# Altium schematic sheet POWER_SHEET.SchDoc
size 381 x 241 mm; SheetNumber: 10; SheetTotal: 12
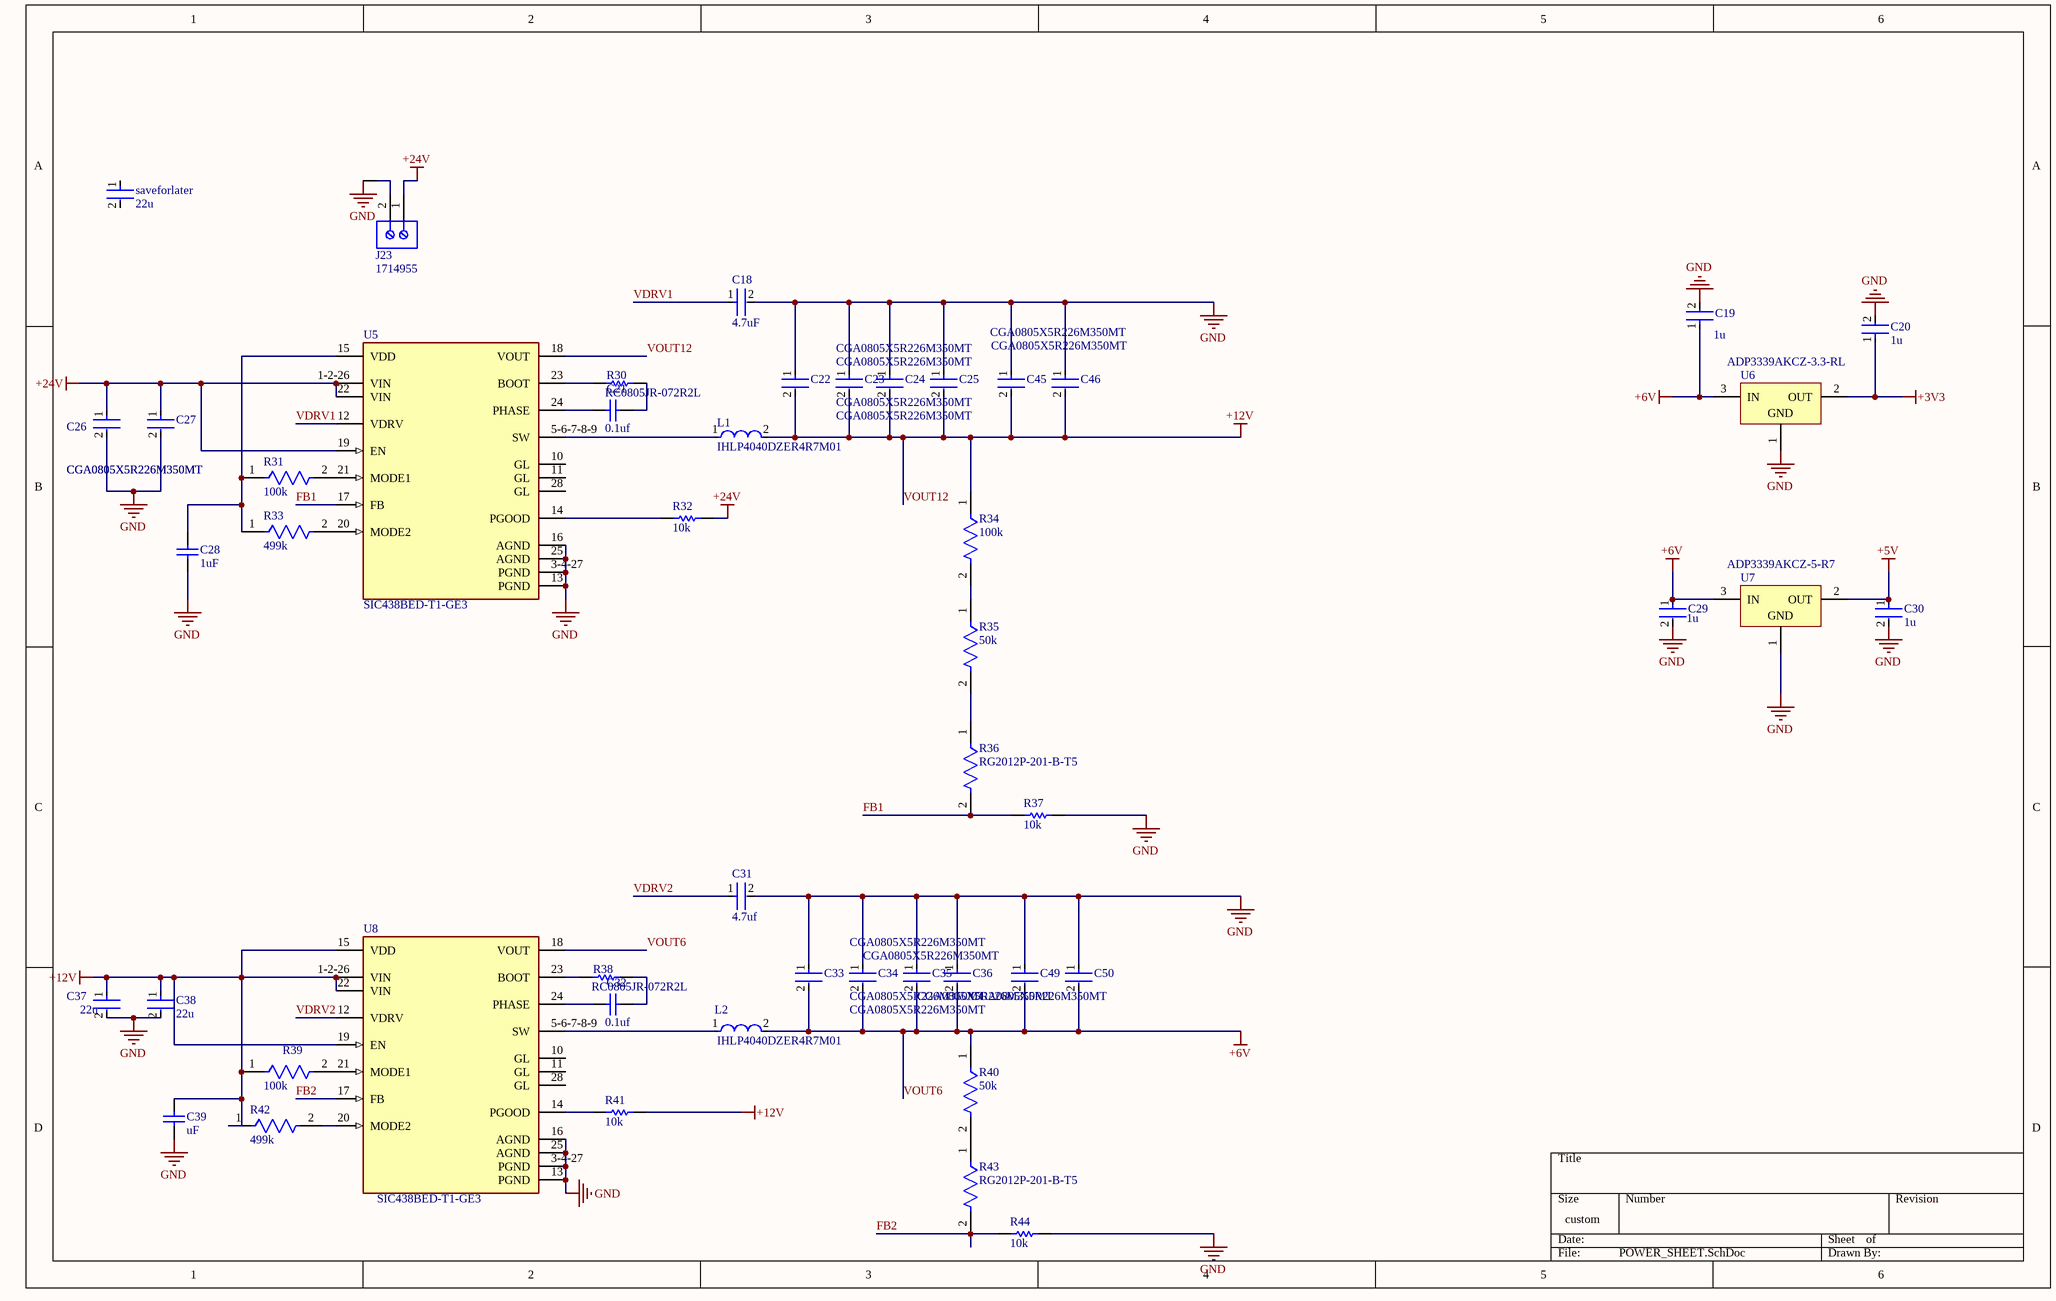
[diagram p0: POWER_SHEET.SchDoc]

## Parts
C18  4.7uF  [FP-CL21-IPC_A]
C19  1u  [FP-CL21-IPC_A]
C20  1u  [FP-CL21-IPC_A]
C21  0.1uf  [CAPC2013X94X50LL20T25]
C22  CGA0805X5R226M350MT  [FP-GRM21B-0_2-e0_2_0_7-IPC_A]
C23  CGA0805X5R226M350MT  [FP-GRM21B-0_2-e0_2_0_7-IPC_A]
C24  CGA0805X5R226M350MT  [FP-GRM21B-0_2-e0_2_0_7-IPC_A]
C25  CGA0805X5R226M350MT  [FP-GRM21B-0_2-e0_2_0_7-IPC_A]
C26  CGA0805X5R226M350MT  [FP-GRM21B-0_2-e0_2_0_7-IPC_A]
C27  CGA0805X5R226M350MT  [FP-GRM21B-0_2-e0_2_0_7-IPC_A]
C28  1uF  [CAPC2013X94X50ML25T25]
C29  1u  [FP-CL21-IPC_A]
C30  1u  [FP-CL21-IPC_A]
C31  4.7uf  [FP-CL21-IPC_A]
C32  0.1uf  [CAPC2013X94X50LL20T25]
C33  CGA0805X5R226M350MT  [FP-GRM21B-0_2-e0_2_0_7-IPC_A]
C34  CGA0805X5R226M350MT  [FP-GRM21B-0_2-e0_2_0_7-IPC_A]
C35  CGA0805X5R226M350MT  [FP-GRM21B-0_2-e0_2_0_7-IPC_A]
C36  CGA0805X5R226M350MT  [FP-GRM21B-0_2-e0_2_0_7-IPC_A]
C37  22u  [FP-CL21-IPC_C]
C38  22u  [FP-CL21-IPC_C]
C39  uF  [CAPC2013X94X50ML25T25]
C45  CGA0805X5R226M350MT  [FP-GRM21B-0_2-e0_2_0_7-IPC_A]
C46  CGA0805X5R226M350MT  [FP-GRM21B-0_2-e0_2_0_7-IPC_A]
C49  CGA0805X5R226M350MT  [FP-GRM21B-0_2-e0_2_0_7-IPC_A]
C50  CGA0805X5R226M350MT  [FP-GRM21B-0_2-e0_2_0_7-IPC_A]
J23  1714955  [PHOE-1714955_V]
L1  IHLP4040DZER4R7M01  [FP-IHLP-4040DZ-FP_3_124x3-MFG]
L2  IHLP4040DZER4R7M01  [FP-IHLP-4040DZ-FP_3_124x3-MFG]
R30  RC0805JR-072R2L  [RESC2013X60X35LL10T20]
R31  100k  [FP-ESR10-MFG]
R32  10k  [RESC2013X60X40LL20T25_A]
R33  499k  [FP-RT0805-MFG]
R34  100k  [FP-ESR10-MFG]
R35  50k  [FP-PNM0805-MFG]
R36  RG2012P-201-B-T5  [FP-RG2012-IPC_A]
R37  10k  [RESC2013X60X40LL20T25_A]
R38  RC0805JR-072R2L  [RESC2013X60X35LL10T20]
R39  100k  [FP-ESR10-MFG]
R40  50k  [FP-PNM0805-MFG]
R41  10k  [RESC2013X60X40LL20T25_A]
R42  499k  [FP-RT0805-MFG]
R43  RG2012P-201-B-T5  [FP-RG2012-IPC_A]
R44  10k  [RESC2013X60X40LL20T25_A]
saveforlater  22u  [FP-CL21-IPC_C]
U5  SIC438BED-T1-GE3  [FP-T22-0442-MFG]
U6  ADP3339AKCZ-3.3-RL  [ADI-KC-3_N]
U7  ADP3339AKCZ-5-R7  [ADI-KC-3_N]
U8  SIC438BED-T1-GE3  [FP-T22-0442-MFG]

## Nets
+3V3: C20.1 U6.2(OUT)
+5V: C30.1 U7.2(OUT)
+24V: C26.1 C27.1 J23.1 R32.2 U5.1-2-26(VIN) U5.19(EN) U5.22(VIN)
GND: C18.2 C19.2 C20.2 C22.1 C23.1 C24.1 C25.1 C26.2 C27.2 C28.1 C29.2 C30.2 C31.2 C33.1 C34.1 C35.1 C36.1 C37.2 C38.2 C39.1 C45.1 C46.1 C49.1 C50.1 J23.2 R37.2 R44.2 U5.3-4-27(PGND) U5.13(PGND) U5.16(AGND) U5.25(AGND) U6.1(GND) U7.1(GND) U8.3-4-27(PGND) U8.13(PGND) U8.16(AGND) U8.25(AGND)
VOUT6: C19.1 C29.1 C33.2 C34.2 C35.2 C36.2 C49.2 C50.2 L2.2 R40.1 U6.3(IN) U7.3(IN) U8.18(VOUT)  [also labelled +6V]
VOUT12: C22.2 C23.2 C24.2 C25.2 C37.1 C38.1 C39.2 C45.2 C46.2 L1.2 R34.1 R39.1 R41.2 R42.1 U5.18(VOUT) U8.1-2-26(VIN) U8.15(VDD) U8.19(EN) U8.22(VIN)  [also labelled +12V]
FB1: R36.2 R37.1 U5.17(FB)
FB2: R43.2 R44.1 U8.17(FB)
VDRV1: C18.1 U5.12(VDRV)
VDRV2: C31.1 U8.12(VDRV)
NetC21_1: C21.1 U5.24(PHASE)
NetC21_2: C21.2 R30.2
NetC28_2: C28.2 R31.1 R33.1 U5.15(VDD)
NetC32_1: C32.1 U8.24(PHASE)
NetC32_2: C32.2 R38.2
NetL1_1: L1.1 U5.5-6-7-8-9(SW)
NetL2_1: L2.1 U8.5-6-7-8-9(SW)
NetR30_1: R30.1 U5.23(BOOT)
NetR31_2: R31.2 U5.21(MODE1)
NetR32_1: R32.1 U5.14(PGOOD)
NetR33_2: R33.2 U5.20(MODE2)
NetR34_2: R34.2 R35.1
NetR35_2: R35.2 R36.1
NetR38_1: R38.1 U8.23(BOOT)
NetR39_2: R39.2 U8.21(MODE1)
NetR40_2: R40.2 R43.1
NetR41_1: R41.1 U8.14(PGOOD)
NetR42_2: R42.2 U8.20(MODE2)

Not connected (* = marked no-connect by the designer): saveforlater 1 2; U5 10(GL) 11(GL) 28(GL); U8 10(GL) 11(GL) 28(GL)

## Library data of the parts
C18 C31 = CMP-13271-002624-1: CL21 Series 0805 4.7uF 25V ±10% Tolerance X5R Multilayer Ceramic Chip Capacitor; Case Code (Imperial): 0805; Thickness: 0.055inch; Mount: Surface Mount; Case Code (Metric): 2012; Capacitance: 4.7uF; Depth: 1.25mm; Lead Free: Lead Free; Case/Package: 0805; Voltage Rating: 25V; Package Quantity: 1; Width: 0.049inch; Radiation Hardening: No; Voltage Rating (DC): 25V; Length: 2mm; Dielectric: X5R; Height: 1.25mm; Packaging: Tape and Reel; Tolerance: 10%; Min Operating Temperature: -55°C; Max Operating Temperature: 85°C
C19 C20 C29 C30 = CMP-13271-003098-1: CL21 Series 0805 1uF 16V ±10% Tolerance X7R Multilayer Ceramic Chip Capacitor; Case Code (Metric): 2012; Width: 0.049inch; Thickness: 0.053inch; Voltage Rating: 16V; Max Operating Temperature: 125°C; Case Code (Imperial): 0805; Height: 1.25mm; Length: 2mm; Case/Package: 0805; Lead Free: Lead Free; Mount: Surface Mount; Capacitance: 1uF; Tolerance: 10%; Voltage Rating (DC): 16V; Min Operating Temperature: -55°C; Contact Plating: Tin; Depth: 1.25mm; Packaging: Tape and Reel; Package Quantity: 1; Voltage: 16V; Dielectric: X7R; Radiation Hardening: No
C21 C32 = CMP-2007-04344-1: Manufacturer: AVX Interconnect / Elco; Part Number: 08055A6R0CAT2A
C22-C27 C33-C36 C45 C46 C49 C50 = CMP-2000-07599-2: Chip Multilayer Ceramic Capacitors for General Purpose, 0805, 100uF, X5R, 15%, 20%, 6.3V; Length: 0.079inch; Dielectric: X5R; Case Code (Metric): 2012; Max Operating Temperature: 85°C; Voltage Rating (DC): 6.3V; Min Operating Temperature: -55°C; Tolerance: 20%; Packaging: Cut Tape; Voltage Rating: 6.3V; Capacitance: 100uF; REACH SVHC: No SVHC; Width: 0.049inch; Mount: Surface Mount; Case/Package: 0805; Case Code (Imperial): 0805; Lead Free: Lead Free; Thickness: 0.057inch
C28 C39 = CMP-2007-04103-1: Manufacturer: AVX Interconnect / Elco; Part Number: LD055C224KAB2A
C37 C38 saveforlater = CMP-13271-003225-1: CL21 Series 0805 22uF 25V ±20% Tolerance X5R Multilayer Ceramic Chip Capacitor
J23 = CMP-2000-05797-1: PC Terminal Block, Pitch 6.35 mm, 1 x 2 Position, Height 21.5 mm, Tail Lenght 5.1 mm, RoHS, Bulk; Manufacturer: Phoenix Contact; Package Description: PC Terminal Block, Pitch 6.35 mm, 1 x 2 Position, Height 21.5 mm, Tail Lenght 5.1 mm; Datasheet URL: http://media.digikey.com/pdf/Data%20Sheets/Phoenix%20Contact%20PDFs/1714955.pdf; Package Reference: 1714955; Manufacturer URL: http://www.phoenixcontact.com/; Datasheet Version: 02/2010; Mounting Technology: ThroughHole
L1 L2 = CMP-02424-000650-1: Commercial Inductors, High Saturation Series 4.7uH 9.5A 16.5mΩ 20%; Shielding: Shielded; DC Resistance (DCR): 16.5mR; Core Material: Metal; Self Resonant Frequency: 5MHz; Test Frequency: 100kHz; Saturation Current: 17A; Min Operating Temperature: -55°C; Max DC Current: 9.5A; RMS Current (Irms): 9.5A; Inductance Tolerance: 20%; Contact Plating: Tin; Tolerance: 20%; Radiation Hardening: No; Length: 0.43inch; Width: 10.3mm; Current Rating: 9.5A; Package Quantity: 500; Mount: Surface Mount; Military Standard: Not; Termination: SMD/SMT; Max Operating Temperature: 125°C; Packaging: Tape and Reel; Lead Free: Lead Free; Height - Seated (Max): 0.157inch; Height: 4mm; Depth: 10.3mm; Case/Package: 4040; Inductance: 4.7uH
R30 R38 = CMP-2001-01364-1: Manufacturer: Yageo; Part Number: RC0805JR-072R2L
R31 R34 R39 = CMP-08839-029189-1: 100kΩ ±5% 0.4W 0805 Anti-Surge Chip Resistor AEC-Q200; Max Power Dissipation: 400mW; Resistance: 100kR; Temperature Coefficient: 200ppm/°C; Features: Automotive AEC-Q200; Packaging: Tape and Reel; Case/Package: 0805; RoHS Compliant: Yes; Min Operating Temperature: -55°C; Tolerance: 5%; Resistor Type: Thick Film; Series: ESR; Max Operating Temperature: 155°C; Case Code (Imperial): 0805; Number of Terminations: 2; Contact Plating: Tin; Case Code (Metric): 2012
R32 R37 R41 R44 = CMP-2001-00582-2: Metal Film Chip Resistor, High Reliability Type, 0.125 W, +/- 0.1%, -55 to 155 degC, 0805 (2012 Metric), RoHS, Tape and Reel; Voltage Rating: 100V; Power Rating: 125mW(1/8W); Brand: Panasonic; Temperature Coefficient: 25PPM/C; Resistance: 10kOhms; Product Category: ThinFilmResistors-SMD; Datasheet Version: 02/2016; Operating Temperature Range: -55Cto+155C; Length: 2mm; Mounting Technology: SurfaceMount; Manufacturer URL: http://www.panasonic.com/; Width: 1.25mm; Packaging: Reel; Product: ThinFilmResistorsSMD; Package / Case: 0805(2012metric); Termination Style: SMD/SMT; Tolerance: 0.1%; Datasheet URL: https://industrial.panasonic.com/cdbs/www-data/pdf/RDM0000/AOA0000C307.pdf; Package Description: 2-Pin Surface Mount Device, Body 2 x 1.25 mm; Factory Pack Quantity: 5000; Series: ERA-6A; Case Code - mm: 2012; RoHS: Details; Package Reference: 0805; Height: 0.5mm; Manufacturer: Panasonic; Case Code - in: 0805; Type: MetalFilmChipResistors
R33 R42 = CMP-03412-000931-1: RES SMD 332K OHM 1% 1/8W 0805; Manufacturer: Yageo; Manufacturer Part Number: RT0805FRE07332KL; Voltage Rating: 150V; Temperature Coefficient: 50 ppm/°C; Value: 332KΩ; Power Rating: 0.125W; Tolerance: 0.0001; Category: Res; RoHS: TRUE; Footprint Url: http://www.yageo.com/exep/pages/download/literatures/PYu-R_Mount_10.pdf; Ipc Land Pattern Name: RESC200125X50; Composition: Thin Film; Device Class L2: Resistors; ComponentLink2URL: http://www.yageo.com/documents/recent/PYu-RT_1-to-0.01_RoHS_L_9.pdf; Device Class L3: Chip SMD Resistors; Device Class L1: Passive Components; Digikey Description: RES SMD 332K OHM 1% 1/8W 0805; Height: 0.6mm; ComponentLink2Description: Datasheet; Automotive: No; Resistance: 332KΩ; Octopart: https://octopart.com/rt0805fre07332kl-yageo-1277672; Temperature Range Low: -55°C; Temperature: -55°C to +155°C; Mouser Description: Thin Film Resistors - SMD 1/8W 332K ohm 1% 50ppm; Temperature Range High: +155°C; Package: RT0805; Series: RT; Lead Free: Yes
R35 R40 = CMP-02407-012955-1: RES SMD 50K OHM 0.1% 1/5W 0805; Power Rating: 200mW; Resistance: 50kR; Temperature Coefficient: 25ppm/°C; Voltage Rating (DC): 100V; Features: Moisture Resistant; Case/Package: 0805; Resistance Tolerance: 0.1%; Max Power Dissipation: 200mW; Length: 0.08inch; Case Code (Imperial): 0805; Tolerance: 0.1%; Height: 0.015inch; Termination: SMD/SMT; Packaging: Tape and Reel; Max Operating Temperature: 155°C; Case Code (Metric): 2012; Min Operating Temperature: -55°C; Number of Terminations: 2; Width: 0.05inch; Resistor Type: Thin Film; Series: PNM; RoHS Compliant: Yes; Voltage Rating: 100V
R36 R43 = CMP-2001-02821-2: Automotive Metal Thin Film Chip Resistor, 0805, 200Ω, 0.1%, 25ppm/°C, 0.125W, 150V; Voltage Rating: 100V; Resistance: 200R; Max Power Dissipation: 125mW; Power Rating: 100mW; Voltage Rating (DC): 150V; Termination: SMD/SMT; Size Code: 0805; Tolerance: 0.1%; Length: 2mm; Width: 1.25mm; Case Code (Metric): 2012; Package Quantity: 5000; Temperature Coefficient: 25ppm/°C; Case/Package: 0805; Packaging: Tape and Reel; Max Operating Temperature: 155°C; Lead Free: Lead Free; RoHS Compliant: Yes; Height: 0.4mm; Series: RG; Case Code (Imperial): 0805; Number of Terminations: 2; Min Operating Temperature: -55°C; Features: Automotive AEC-Q200
U5 U8 = CMP-00030-87948109-1: SIC438BED-T1-GE3 Synchronous Buck Regulator Power Saving 28V I/P Adjustable O/P 8A 24-Pin PowerPAK MLP44 T/R; Output Voltage: 20V; NexarPartId: 87948109; RoHS: Non-Compliant; Schedule B: 8542390000; Output Current: 8A
U6 = CMP-0786-00155-1: High Accuracy, Ultralow IQ, 1.5 A, anyCAP Low Dropout Regulator, 2.8 to 6 V Vin, 3.3 V Vout, Industrial, 3-pin SOT223 (KC-3), Reel; Manufacturer: Analog Devices; Preset Vout Values (V): 3.3; Vin (max) (V): 6; Iout max: 1.5A; Vin (min) (V): 2.8; Supply Current IGND @ Small Load: 130uA; PackageDescription: 3-Pin Small Outline Transistor Package, Body 3.5 x 6.5 mm, Pitch 2.3 mm; ComponentLink2Description: Datasheet; PackageReference: KC-3; ComponentLink4URL: Product URL:http://www.analog.com/en/ADP3339/productSearch.html; ComponentLink2URL: http://www.analog.com/static/imported-files/data_sheets/ADP3339.pdf; ComponentLink3URL: http:/www.analog.com/static/imported-files/packages/PKG_PDF/SOT_223(KC)/KC_3.pdf; Mounting Technology: Surface Mount; Code_JEDEC: TO-261-AA; ComponentLink1URL: http://www.analog.com/en/index.html; PartNumber: ADP3339AKCZ-3.3-RL; ComponentLink3Description: Package Specification; ComponentLink1Description: Manufacturer URL; PackageVersion: 11-20-2012-B, 11/2012; DatasheetVersion: Rev. C; ComponentLink4Description: URL Link1; Packing: Reel
U7 = CMP-0786-00154-1: High Accuracy, Ultralow IQ, 1.5 A, anyCAP Low Dropout Regulator, 2.8 to 6 V Vin, 5 V Vout, Industrial, 3-pin SOT223 (KC-3), Reel; Manufacturer: Analog Devices; Iout max: 1.5A; Supply Current IGND @ Small Load: 130uA; Vin (max) (V): 6; Preset Vout Values (V): 5.0; Vin (min) (V): 2.8; ComponentLink2Description: Datasheet; DatasheetVersion: Rev. C; Packing: Reel; ComponentLink1URL: http://www.analog.com/en/index.html; PackageVersion: 11-20-2012-B, 11/2012; ComponentLink4Description: URL Link1; Code_JEDEC: TO-261-AA; Mounting Technology: Surface Mount; ComponentLink1Description: Manufacturer URL; ComponentLink3Description: Package Specification; PackageDescription: 3-Pin Small Outline Transistor Package, Body 3.5 x 6.5 mm, Pitch 2.3 mm; ComponentLink4URL: Product URL:http://www.analog.com/en/ADP3339/productSearch.html; ComponentLink2URL: http://www.analog.com/static/imported-files/data_sheets/ADP3339.pdf; PackageReference: KC-3; PartNumber: ADP3339AKCZ-5-R7; ComponentLink3URL: http:/www.analog.com/static/imported-files/packages/PKG_PDF/SOT_223(KC)/KC_3.pdf